# EAGLE schematic PyroelectricSensor (EAGLE 6.3)
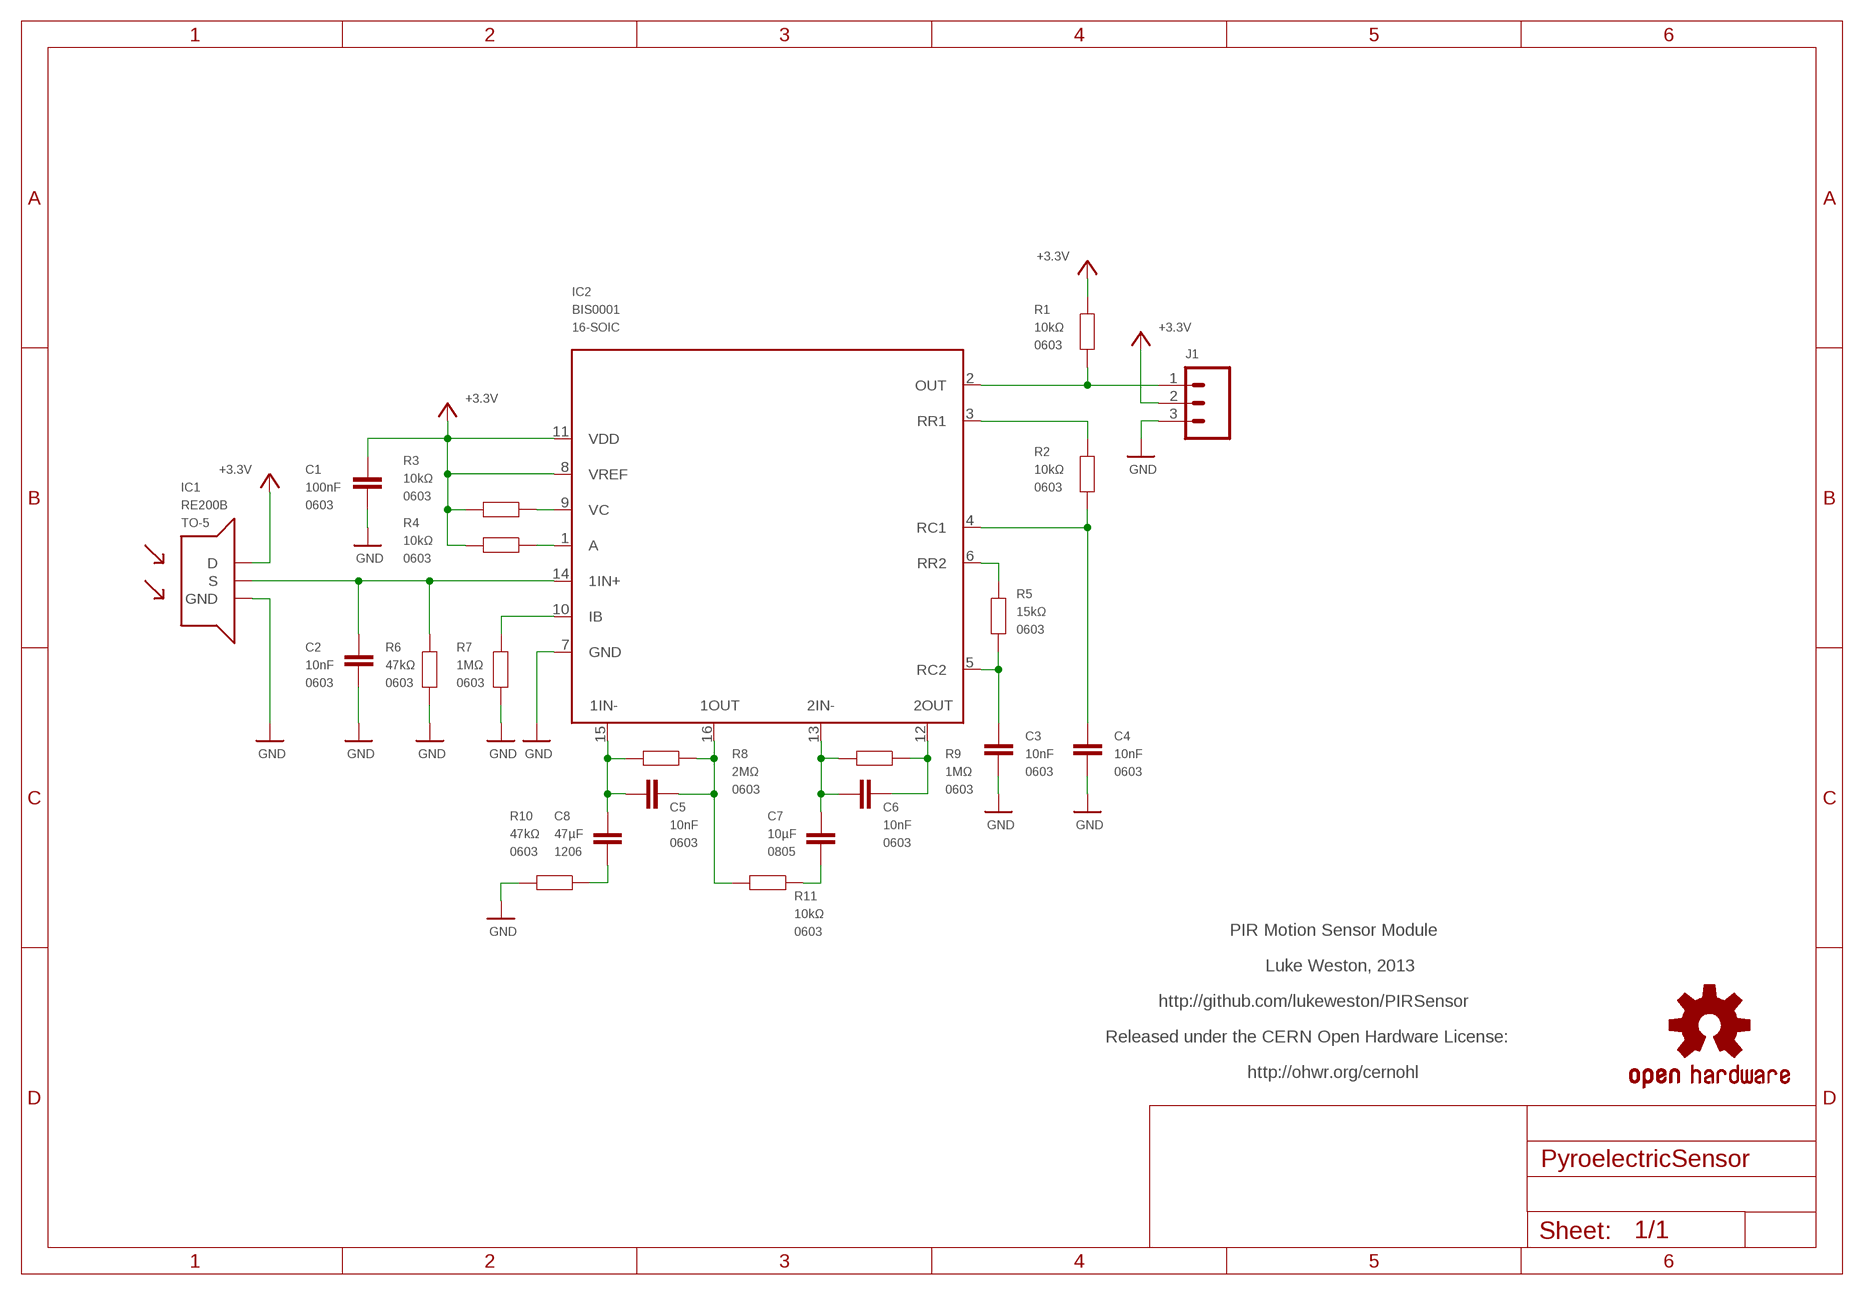
[diagram p0: schematic, sheet 1]

## Parts
C1  100nF  CAP0603  [0603]
C2  10nF  CAP0603  [0603]
C3  10nF  CAP0603  [0603]
C4  10nF  CAP0603  [0603]
C5  10nF  CAP0603  [0603]
C6  10nF  CAP0603  [0603]
C7  10µF  CAP0805  [0805]
C8  47µF  C-EUC1206K  [C1206K]
IC1  RE200B  [TO5-CAN]
IC2  BIS0001  [16-SOIC]
J1  M03PTH  [1X03]
R1  10kΩ  RESISTOR0603  [0603]
R2  10kΩ  RESISTOR0603  [0603]
R3  10kΩ  RESISTOR0603  [0603]
R4  10kΩ  RESISTOR0603  [0603]
R5  15kΩ  RESISTOR0603  [0603]
R6  47kΩ  RESISTOR0603  [0603]
R7  1MΩ  RESISTOR0603  [0603]
R8  2MΩ  RESISTOR0603  [0603]
R9  1MΩ  RESISTOR0603  [0603]
R10  47kΩ  RESISTOR0603  [0603]
R11  10kΩ  RESISTOR0603  [0603]
SY  OSHW-LOGOS  [OSHW-LOGO-S]

## Nets
+3V3: C1.1 IC1.1(D) IC2.8(VREF) IC2.11(VDD) J1.2 R1.2 R3.2 R4.2 ; supply symbol labelled +3.3V
GND: C1.2 C2.2 C3.2 C4.2 IC1.3(GND) IC2.7(GND) J1.3 R6.1 R7.1 R10.2
N$1: IC2.6(RR2) R5.2
N$2: IC2.10(IB) R7.2
N$3: C5.1 C8.2 IC2.15(1IN-) R8.2
N$4: IC2.2(OUT) J1.1 R1.1
N$5: IC2.1(A) R4.1
N$6: IC2.3(RR1) R2.2
N$7: C4.1 IC2.4(RC1) R2.1
N$8: C3.1 IC2.5(RC2) R5.1
N$9: IC2.9(VC) R3.1
N$10: C2.1 IC1.2(S) IC2.14(1IN+) R6.2
N$11: C6.1 C7.2 IC2.13(2IN-) R9.2
N$12: C6.2 IC2.12(2OUT) R9.1
N$13: C5.2 IC2.16(1OUT) R8.1 R11.2
N$14: C7.1 R11.1
N$15: C8.1 R10.1

## Notes on the sheet
- PIR Motion Sensor Module
- Luke Weston, 2013
- http://github.com/lukeweston/PIRSensor
- Released under the CERN Open Hardware License:
- http://ohwr.org/cernohl

## Library data of the parts
C1-C6 = freetronics-master-v1:CAP: Capacitor Standard 0603 ceramic capacitor, and 0.1" leaded capacitor.; PACKAGE: 0603
C7 = freetronics-master-v1:CAP: Capacitor Standard 0603 ceramic capacitor, and 0.1" leaded capacitor.; PACKAGE: 0805
C8 = rcl:C-EU: CAPACITOR, European symbol; PACKAGE: 1206
IC1 = freetronics-luke:RE200B: RE200B pyroelectric (PIR) motion sensor with JFET output; PACKAGE: TO-5
IC2 = freetronics-luke:BIS0001: BIS0001 pyroelectric motion detector IC; PACKAGE: 16-SOIC
J1 = freetronics-master-v1:M03: Header 3 Standard 3-pin 0.1" header. Use with straight break away headers (SKU : PRT-00116), right angle break away headers (PRT-00553), swiss pins (PRT-00743), machine pins (PRT-00117), and female headers (PRT-00115). Molex polarized connector foot print use with SKU : PRT-08232 with associated crimp pins and housings.
R1-R11 = freetronics-master-v1:RESISTOR: Resistor Basic schematic elements and footprints for 0603, 1206, and PTH 1/10th watt (small) resistors.; PACKAGE: 0603
SY = SparkFun:OSHW-LOGO: Open Source Hardware Logo This logo indicates the piece of hardware it is found on incorporates a OSHW license and/or adheres to the definition of open source hardware found here: http://freedomdefined.org/OSHW